# Altium schematic sheet 3-Power&Peripherals.schdoc
size 313 x 200 mm
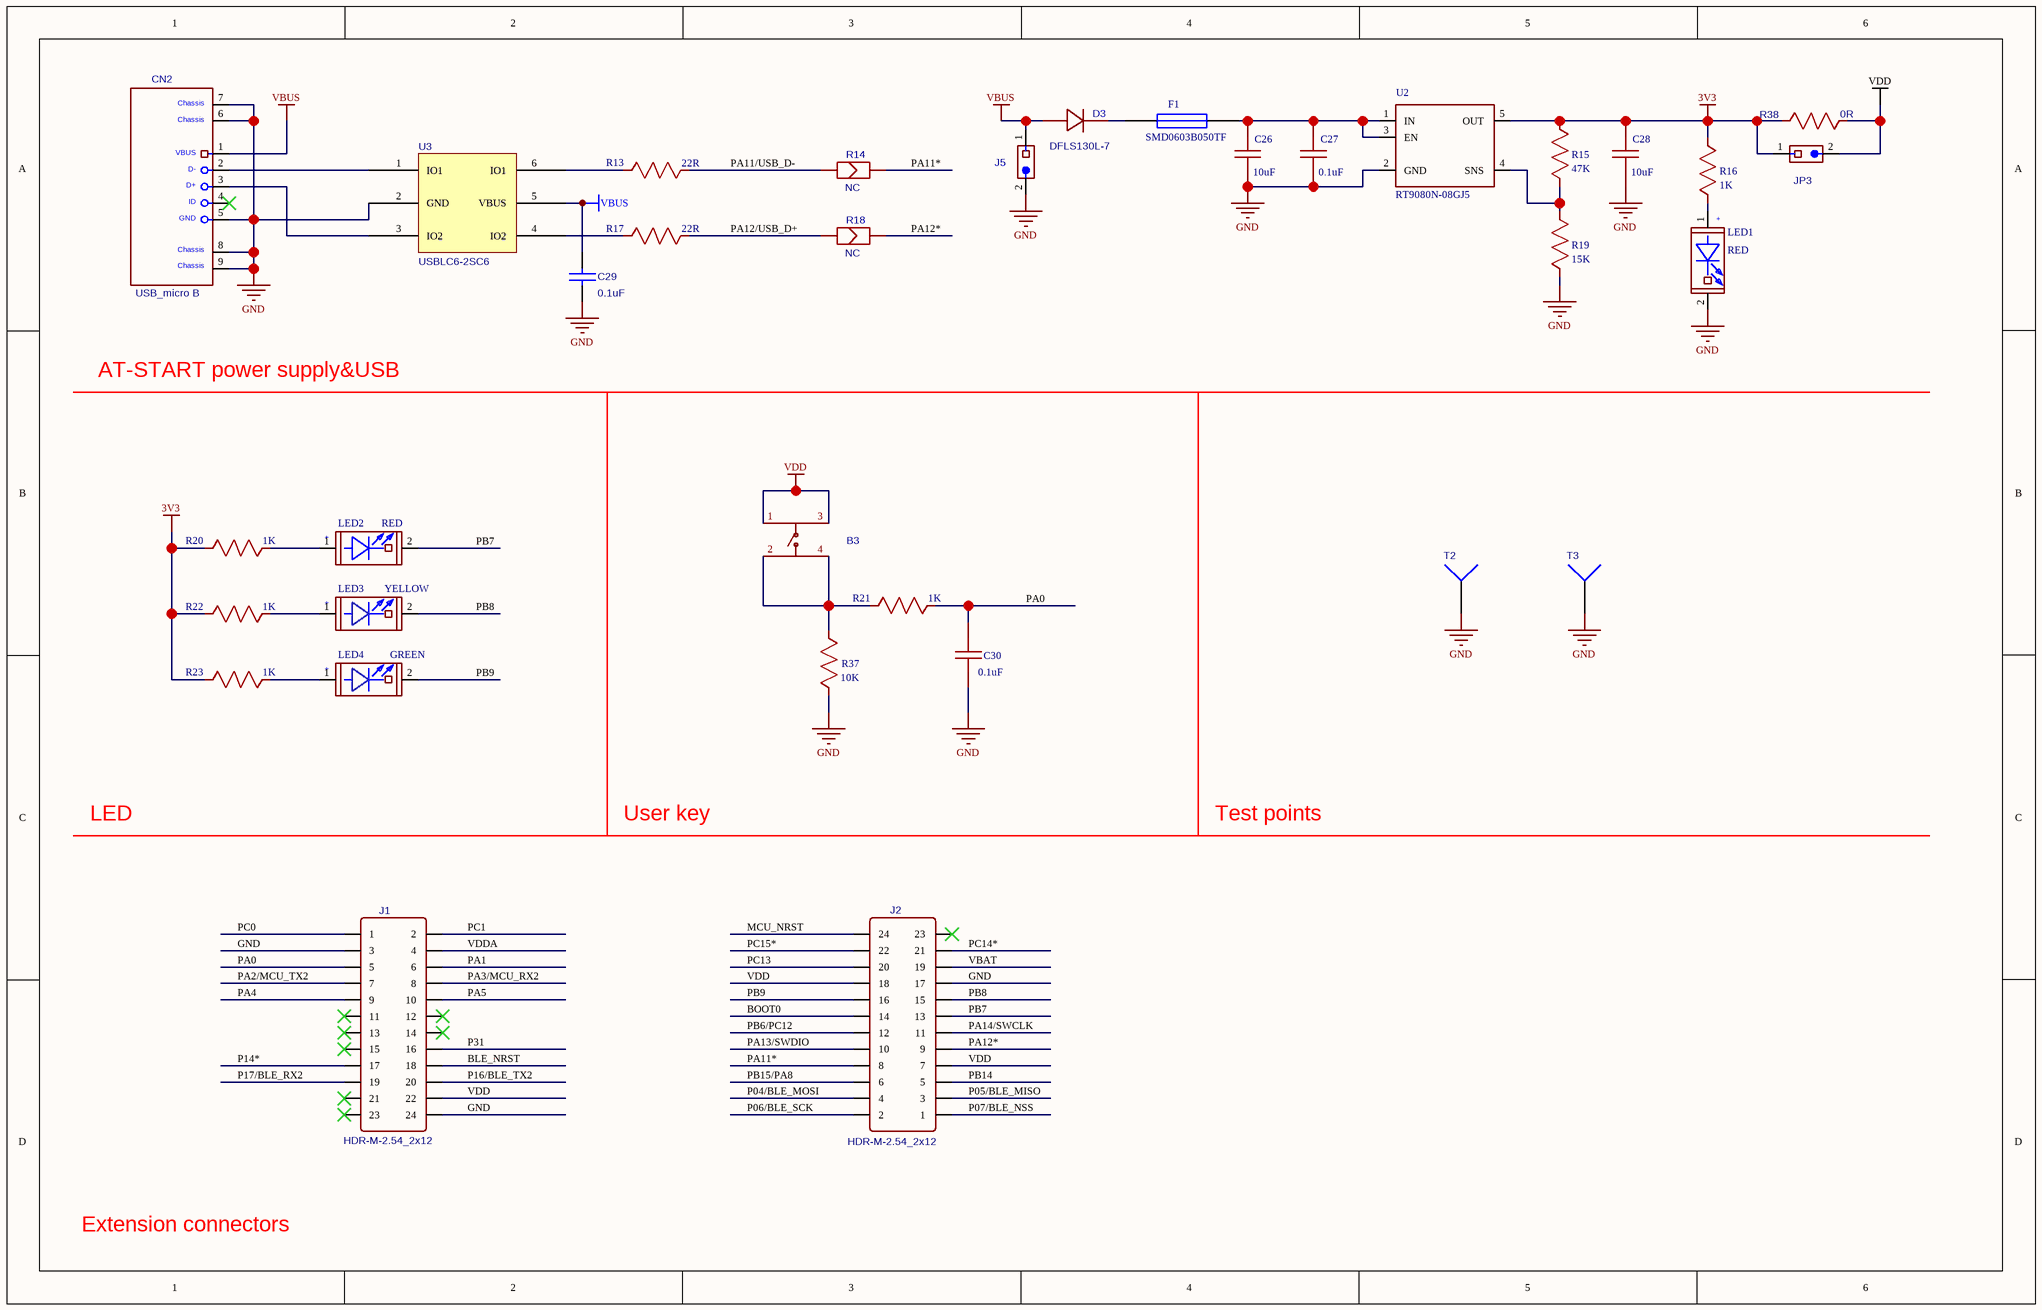
[diagram p0: 3-Power&Peripherals.schdoc]

## Parts
B3  贴片按键6*6*5 蓝色  [SW-SMD_4P-L6.0-W6.0-P4.50-LS9.0]  (value not drawn)
C26  10uF  [0603_C-M]
C27  0.1uF  [0603_C-M]
C28  10uF  [0603_C-M]
C29  0.1uF  [0603_C-M]
C30  0.1uF  [0603_C-M]
CN2  USB_micro B  [USB_MIC_DIP]
D3  DFLS130L-7  [POWERDI-123_L2.8-W1.8-LS3.7-RD]
F1  SMD0603B050TF  [R0603]
J1  HDR-M-2.54_2x12  [HDR-TH_24P-P2.54-V-F-R2-C12-S2.54]
J2  HDR-M-2.54_2x12  [HDR-TH_24P-P2.54-V-F-R2-C12-S2.54]
J5  1X2P,Male,DIP_2.54  [HDR1X2]  (value not drawn)
JP3  Jumper 1x2P  [HEADER 1X2]  (value not drawn)
LED1  RED  [LED0603]
LED2  RED  [LED0603]
LED3  YELLOW  [LED0603]
LED4  GREEN  [LED0603]
R13  22R  [0603_R-M]
R14  NC  [SB-PAD]
R15  47K  [0603_R-M]
R16  1K  [0603_R-M]
R17  22R  [0603_R-M]
R18  NC  [SB-PAD]
R19  15K  [0603_R-M]
R20  1K  [0603_R-M]
R21  1K  [0603_R-M]
R22  1K  [0603_R-M]
R23  1K  [0603_R-M]
R37  10K  [0603_R-M]
R38  0R  [0603_R-M]
T2  Testpoint  [TESTHOOK]  (value not drawn)
T3  Testpoint  [TESTHOOK]  (value not drawn)
U2  RT9080N-08GJ5  [SOT-23-5]
U3  USBLC6-2SC6  [SOT-23-6]

## Nets
3V3: C28.1 JP3.1 R15.2 R16.1 R20.2 R22.2 R23.2 R38.1 U2.5(OUT)
GND: C26.2 C27.2 C28.2 C29.1 C30.1 CN2.5(GND) CN2.6 CN2.7 CN2.8 CN2.9 J1.3 J1.24 J2.17 J5.2 LED1.2(CATHODE) R19.1 R37.2 T2.1 T3.1 U2.2(GND) U3.2(GND)
VBUS: C29.2 CN2.1(VBUS) D3.2 J5.1 U3.5(VBUS)
VDD: B3.1 B3.3 J1.22 J2.7 J2.18 JP3.2 R38.2
BLE_NRST: J1.18
BOOT0: J2.14
MCU_NRST: J2.24
P04/BLE_MOSI: J2.4
P05/BLE_MISO: J2.3
P06/BLE_SCK: J2.2
P07/BLE_NSS: J2.1
P14*: J1.17
P16/BLE_TX2: J1.20
P17/BLE_RX2: J1.19
P31: J1.16
PA0: C30.2 J1.5 R21.1
PA1: J1.6
PA2/MCU_TX2: J1.7
PA3/MCU_RX2: J1.8
PA4: J1.9
PA5: J1.10
PA11*: J2.8 R14.2
PA11/USB_D-: R13.1 R14.1
PA12*: J2.9 R18.2
PA12/USB_D+: R17.1 R18.1
PA13/SWDIO: J2.10
PA14/SWCLK: J2.11
PB6/PC12: J2.12
PB7: J2.13 LED2.2(CATHODE)
PB8: J2.15 LED3.2(CATHODE)
PB9: J2.16 LED4.2(CATHODE)
PB14: J2.5
PB15/PA8: J2.6
PC0: J1.1
PC1: J1.2
PC13: J2.20
PC14*: J2.21
PC15*: J2.22
VBAT: J2.19
VDDA: J1.4
NetB3_2: B3.2 B3.4 R21.2 R37.1
NetC26_1: C26.1 C27.1 F1.2 U2.1(IN) U2.3(EN)
NetCN2_2: CN2.2(D-) U3.1(IO1)
NetCN2_3: CN2.3(D+) U3.3(IO2)
NetD3_1: D3.1 F1.1
NetLED1_1: LED1.1(ANODE) R16.2
NetLED2_1: LED2.1(ANODE) R20.1
NetLED3_1: LED3.1(ANODE) R22.1
NetLED4_1: LED4.1(ANODE) R23.1
NetR13_2: R13.2 U3.6(IO1)
NetR15_1: R15.1 R19.2 U2.4(SNS)
NetR17_2: R17.2 U3.4(IO2)

Not connected (* = marked no-connect by the designer): CN2 4(ID)*; J1 11* 12* 13* 14* 15* 21* 23*; J2 23*

## Notes on the sheet
- AT-START power supply&USB
- LED
- User key
- Test points
- Extension connectors
- (in symbol GREEN) +
- (in symbol RED) +
- (in symbol USB_micro B) Chassis
- (in symbol YELLOW) +

## Library data of the parts
B3 = 贴片按键6*6*5 蓝色: BOM_Manufacturer: Korean Hroparts Elec; BOM_Manufacturer Part: K2-1102SP-C3SC-04; Contributor: LCSC; BOM_Paste Type: expand; BOM_Supplier: LCSC; BOM_Supplier Part: C707347; spicePre: S; spiceSymbolName: K2-1102SP-C3SC-04
C26 C28 = 10uF: nameAlias: Value(F); Contributor: LCEDA_Lib; spicePre: C; spiceSymbolName: C_0603_US
C27 C30 = 0.1uF: nameAlias: Value(F); Contributor: LCEDA_Lib; spicePre: C; spiceSymbolName: C_0603_US
D3 = DFLS130L-7: BOM_Manufacturer: Diodes Incorporated; Contributor: LCSC; BOM_Paste Type: expand; BOM_Supplier: LCSC; BOM_Supplier Part: C110493; BOM_Manufacturer Part: DFLS130L-7; spicePre: D; spiceSymbolName: DFLS130L-7
J1 J2 = HDR-M-2.54_2x12: Contributor: twb17; spicePre: J; spiceSymbolName: HDR-M-2.54_2x12
J5 = 1X2P,Male,DIP_2.54: Contributor: twb17; spicePre: J; spiceSymbolName: 1X2P,Male,DIP_2.54
JP3 = Jumper 1x2P: Contributor: twb17; spicePre: J; spiceSymbolName: Jumper 1x2P
R13 R17 = 22R: nameAlias: Value(Ω); Contributor: LCEDA_Lib; spicePre: R; spiceSymbolName: R_0603_US
R14 R18 = NC: Contributor: twb17; spicePre: R; spiceSymbolName: Solder bridge
R15 = 47K: nameAlias: Value(Ω); Contributor: LCEDA_Lib; spicePre: R; spiceSymbolName: R_0603_US
R16 R20-R23 = 1K: nameAlias: Value(Ω); Contributor: LCEDA_Lib; spicePre: R; spiceSymbolName: R_0603_US
R19 = 15K: nameAlias: Value(Ω); Contributor: LCEDA_Lib; spicePre: R; spiceSymbolName: R_0603_US
R37 = 10K: nameAlias: Value(Ω); Contributor: LCEDA_Lib; spicePre: R; spiceSymbolName: R_0603_US
R38 = 0R: nameAlias: Value(Ω); Contributor: LCEDA_Lib; spicePre: R; spiceSymbolName: R_0603_US
F1 = SMD0603B050TF: Published: 8-Jun-2000; LatestRevisionDate: 17-Jul-2002; LatestRevisionNote: Re-released for DXP Platform.; PackageReference: PIN-W2/E2.8; Publisher: Altium Limited; PackageDescription: Thru-Hole; 2 Leads
T2 T3 = Testpoint: LatestRevisionDate: 17-Jul-2002; LatestRevisionNote: Re-released for DXP Platform.; Publisher: Altium Limited